# Altium schematic sheet LPCB220 - CORE A.SchDoc
size A3; Address1: Factory 10; Address2: 9-13 Dingley Avenue, Dandeong, VICTORIA 3175, AUSTRALIA; DocumentNumber: 4; Revision: 1; SheetNumber: 4; SheetTotal: 18; Lockie__PCB_SUB_ASSEMBLY: Node Core A; Lockie__PCB_ASSEMBLY: Brake Control; Lockie__LDL: LPCB220; Lockie__PCB_DESCRIPTION: Redundant Stepper Node
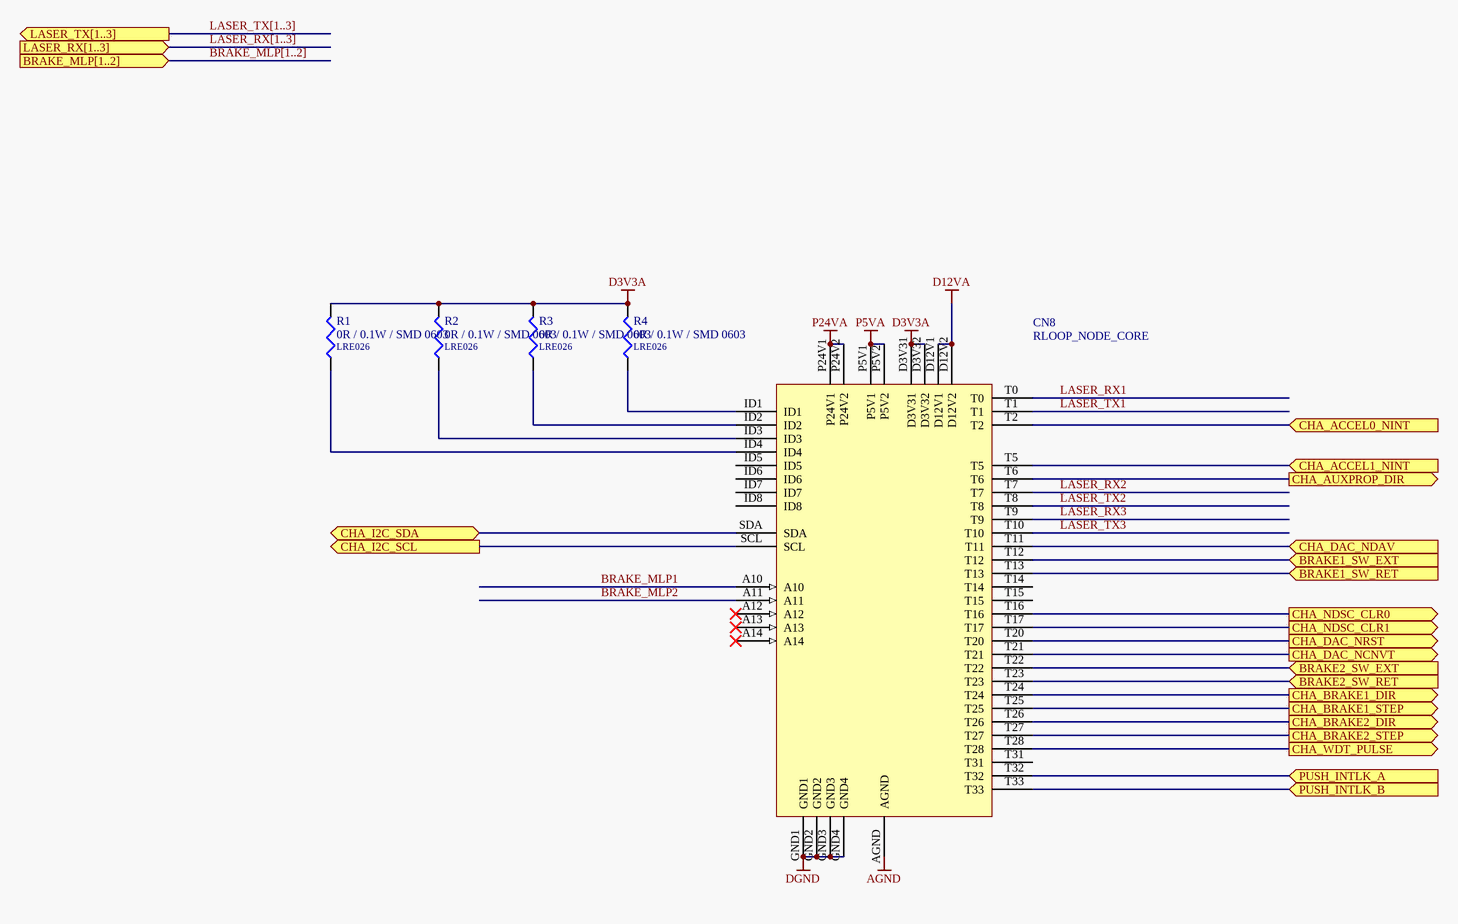
[diagram p0: LPCB220 - CORE A.SchDoc]

## Parts
CN8  RLOOP_NODE_CORE  [RLOOP_NODE_CORE]  (no BOM)
R1  0R / 0.1W / SMD 0603  LDL_NUMBER: LRE026  [LFP020__CR1608-0603-IPC7351_B]
R2  0R / 0.1W / SMD 0603  LDL_NUMBER: LRE026  [LFP020__CR1608-0603-IPC7351_B]
R3  0R / 0.1W / SMD 0603  LDL_NUMBER: LRE026  [LFP020__CR1608-0603-IPC7351_B]
R4  0R / 0.1W / SMD 0603  LDL_NUMBER: LRE026  [LFP020__CR1608-0603-IPC7351_B]

## Ports
BRAKE1_SW_EXT (in), BRAKE1_SW_RET (in), BRAKE2_SW_EXT (in), BRAKE2_SW_RET (in), BRAKE_MLP[1..2] (in), CHA_ACCEL0_NINT (in), CHA_ACCEL1_NINT (in), CHA_AUXPROP_DIR (out), CHA_BRAKE1_DIR (out), CHA_BRAKE1_STEP (out), CHA_BRAKE2_DIR (out), CHA_BRAKE2_STEP (out), CHA_DAC_NCNVT (out), CHA_DAC_NDAV (in), CHA_DAC_NRST (out), CHA_I2C_SCL (out), CHA_I2C_SDA (bidir), CHA_NDSC_CLR0 (out), CHA_NDSC_CLR1 (out), CHA_WDT_PULSE (out), LASER_RX[1..3] (in), LASER_TX[1..3] (out), PUSH_INTLK_A (in), PUSH_INTLK_B (in)

## Nets
AGND: CN8.AGND
D3V3A: CN8.D3V31 CN8.D3V32 R1.2 R2.2 R3.2 R4.2
D12VA: CN8.D12V1 CN8.D12V2
DGND: CN8.GND1 CN8.GND2 CN8.GND3 CN8.GND4
P5VA: CN8.P5V1 CN8.P5V2
P24VA: CN8.P24V1 CN8.P24V2
BRAKE1_SW_EXT: CN8.T12 ; port BRAKE1_SW_EXT
BRAKE1_SW_RET: CN8.T13 ; port BRAKE1_SW_RET
BRAKE2_SW_EXT: CN8.T22 ; port BRAKE2_SW_EXT
BRAKE2_SW_RET: CN8.T23 ; port BRAKE2_SW_RET
BRAKE_MLP1: CN8.A10
BRAKE_MLP2: CN8.A11
CHA_ACCEL0_NINT: CN8.T2 ; port CHA_ACCEL0_NINT
CHA_ACCEL1_NINT: CN8.T5 ; port CHA_ACCEL1_NINT
CHA_AUXPROP_DIR: CN8.T6 ; port CHA_AUXPROP_DIR
CHA_BRAKE1_DIR: CN8.T24 ; port CHA_BRAKE1_DIR
CHA_BRAKE1_STEP: CN8.T25 ; port CHA_BRAKE1_STEP
CHA_BRAKE2_DIR: CN8.T26 ; port CHA_BRAKE2_DIR
CHA_BRAKE2_STEP: CN8.T27 ; port CHA_BRAKE2_STEP
CHA_DAC_NCNVT: CN8.T21 ; port CHA_DAC_NCNVT
CHA_DAC_NDAV: CN8.T11 ; port CHA_DAC_NDAV
CHA_DAC_NRST: CN8.T20 ; port CHA_DAC_NRST
CHA_I2C_SCL: CN8.SCL ; port CHA_I2C_SCL
CHA_I2C_SDA: CN8.SDA ; port CHA_I2C_SDA
CHA_NDSC_CLR0: CN8.T16 ; port CHA_NDSC_CLR0
CHA_NDSC_CLR1: CN8.T17 ; port CHA_NDSC_CLR1
CHA_WDT_PULSE: CN8.T28 ; port CHA_WDT_PULSE
LASER_RX1: CN8.T0
LASER_RX2: CN8.T7
LASER_RX3: CN8.T9
LASER_TX1: CN8.T1
LASER_TX2: CN8.T8
LASER_TX3: CN8.T10
PUSH_INTLK_A: CN8.T32 ; port PUSH_INTLK_A
PUSH_INTLK_B: CN8.T33 ; port PUSH_INTLK_B
NetCN8_ID1: CN8.ID1 R4.1
NetCN8_ID2: CN8.ID2 R3.1
NetCN8_ID3: CN8.ID3 R2.1
NetCN8_ID4: CN8.ID4 R1.1

Not connected (* = marked no-connect by the designer): CN8 A12* A13* A14* ID5 ID6 ID7 ID8 T14 T15 T31

## Buses and harness runs
bus BRAKE_MLP[1..2] = port BRAKE_MLP[1..2]
bus LASER_RX[1..3] = port LASER_RX[1..3]
bus LASER_TX[1..3] = port LASER_TX[1..3]

## Notes on the sheet
- PCB COMPONENT DESCRIPTION
- LDL NUMBER
- Assembly Details
- Size
- Drawing File Name
- Revision
- http://rloop.org
- Scale
- A3
- Sheet Details
- N.T.S
- Sheet:
- Of:

## Library data of the parts
CN8 = RLOOP_NODE_CORE: rLoop Node Core Connector; FMEDA__CHANNEL: COM; FMEDA__OPERATING__CURRENT_MAX: 0; FMEDA__OPERATING__TEMP_MAX: 50; FMEDA__OPERATING__TEMP_MIN: -20; FMEDA__OPERATING__TEMP_TYP: 27; FMEDA__OPERATING__VOLTAGE_MAX: 16; FMEDA__OPERATING__VOLTAGE_TYP: 12; FMEDA__OPERATING__CURRENT_MIN: 0; FMEDA__OPERATING__CURRENT_TYP: 0; FMEDA__OPERATING__VOLTAGE_MIN: 0
R1-R4 = 0R / 0.1W / SMD 0603: Resistor, Ceramic Chip, 0R, 0.1W, SMD 0603 [LRE026]; Value: 0; FMEDA__OPERATING__TEMP_MAX: 50; FMEDA__OPERATING__TEMP_MIN: -20; FMEDA__OPERATING__TEMP_TYP: 27; FMEDA__CHANNEL: COM; FMEDA__OPERATING__POWER_MAX: 0; FMEDA__OPERATING__POWER_MIN: 0; FMEDA__OPERATING__VOLTAGE_MAX: 0; FMEDA__OPERATING__VOLTAGE_MIN: 0; FMEDA__OPERATING__VOLTAGE_TYP: 0; FMEDA__FUNCTION_IN_SYSTEM: *